# Altium project SX1308.PrjPcb
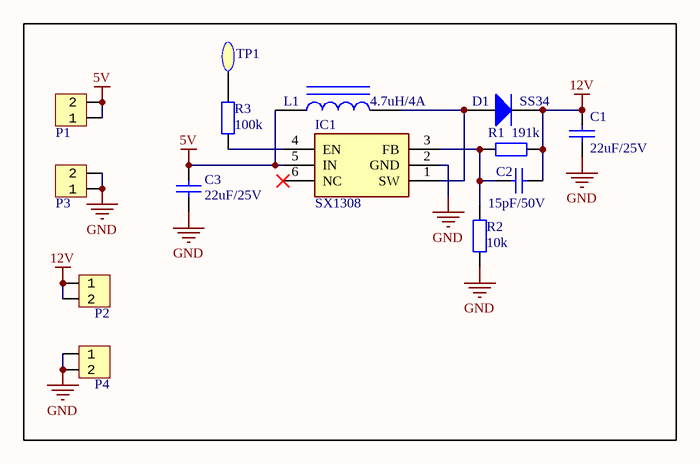
[diagram p0: SX1308.SchDoc]
1 sheet, 14 parts. Net scope: global (net labels, ports and power ports of the same name join across sheets).
Board files: SX1308.PcbDoc, SX1308_V2.PcbDoc

## Sheet SX1308.SchDoc
size 292 x 193 mm; Author: Power Lin; SheetNumber: 1; SheetTotal: 1; Website: wiki-power.com

### Parts
C1  22uF/25V  [CAP-0603]
C2  15pF/50V  [CAP-0603]
C3  22uF/25V  [CAP-0603]
D1  SS34  [DO-214AC_SMA]
IC1  SX1308  [SOT-23-6]
L1  4.7uH/4A  [SMD_7.3x7.3x4.2mm]
P1  HDR1x2_2.54  [HDR1X2_2.54_180]  (value not drawn)
P2  HDR1x2_2.54  [HDR1X2_2.54_180]  (value not drawn)
P3  HDR1x2_2.54  [HDR1X2_2.54_180]  (value not drawn)
P4  HDR1x2_2.54  [HDR1X2_2.54_180]  (value not drawn)
R1  191k  [R-0603]
R2  10k  [R-0603]
R3  100k  [R-0603]
TP1  TestPoint  [TestPoint]  (value not drawn)

### Nets
5V: C3.2 IC1.5(IN) L1.1 P1.1 P1.2
12V: C1.2 C2.2 D1.2(K) P2.1 P2.2 R1.2
GND: C1.1 C3.1 IC1.2(GND) P3.1 P3.2 P4.1 P4.2 R2.1
NetC2_1: C2.1 IC1.3(FB) R1.1 R2.2
NetD1_1: D1.1(A) IC1.1(SW) L1.2
NetIC1_4: IC1.4(EN) R3.2
NetR3_1: R3.1 TP1.1

Not connected (* = marked no-connect by the designer): IC1 6(NC)*

### Notes on the sheet
- Author
- DocumentName
- ModifiedDate
- ProjectName
- SheetNumber
- SheetTotal
- Website
- Revision

### Library data of the parts
C1 C3 = CAP: X7R; ComponentLink1Description: 供应商链接; ComponentLink1URL: http://www.szlcsc.com/product/details_53938.html; Package: 0402; Supplier: LC; SuppliersPartNumber: C52923
C2 = CAP: NPO; ComponentLink1Description: 供应商链接; ComponentLink1URL: http://www.szlcsc.com/product/details_53938.html; Package: 0402; Supplier: LC; SuppliersPartNumber: C52923
D1 = DIODE: 肖特基二极管; ComponentLink1Description: 供应商链接; ComponentLink1URL: http://www.szlcsc.com/product/details_23178.html; Package: SMA(DO-214AC); Supplier: LC; SuppliersPartNumber: C22452
IC1 = SX1308: 集成升压芯片; Manufacturer_Name: Shenzhen Suosemi Tech; Datasheet Link: https://datasheet.lcsc.com/szlcsc/Shenzhen-Suosemi-Tech-SX1308_C78162.pdf; Height: 1.45mm; Manufacturer_Part_Number: SX1308
L1 = INDUCTOR: 电感; ComponentLink1Description: 供应商链接; ComponentLink1URL: http://www.szlcsc.com/product/details_33003.html; Package: 0402; Supplier: LC; SuppliersPartNumber: C32041
P1-P4 = HDR1x2_2.54: Header
R1-R3 = RES: 贴片电阻; Package: 0805; Supplier: LC; SuppliersPartNumber: C17798
TP1 = TestPoint: 测试点